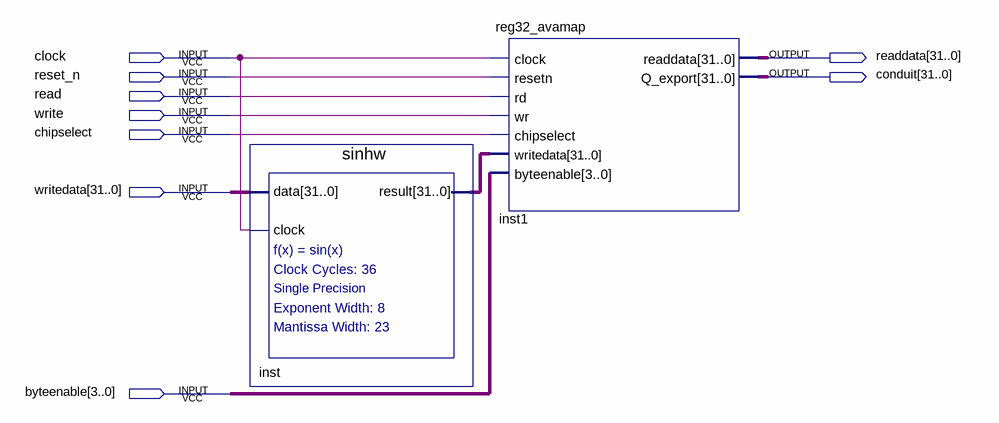
[diagram p0: schematic sheet]
// Quartus schematic hwsin.bdf as structural Verilog: 2 symbols, 9 pins
module hwsin (
  input  clock,
  input  reset_n,
  input  read,
  input  write,
  input  chipselect,
  input  [31:0] writedata,
  input  [3:0] byteenable,
  output [31:0] readdata,
  output [31:0] conduit
);

  wire [31:0] inst_result;

  sinhw inst (.data(writedata), .clock(clock), .result(inst_result));
  reg32_avamap inst1 (
    .clock(clock), .resetn(reset_n), .rd(read), .wr(write), .chipselect(chipselect), .writedata(inst_result),
    .byteenable(byteenable), .readdata(readdata), .Q_export(conduit));
endmodule
